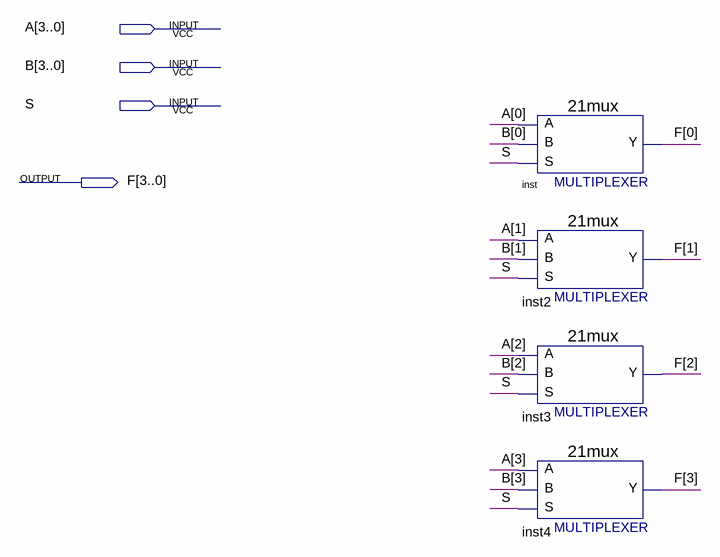
[diagram p0: schematic sheet]
// Quartus schematic BUSMUX_2x1_4Width.bdf as structural Verilog: 4 symbols, 4 pins
module BUSMUX_2x1_4Width (
  input  [3:0] A,
  input  [3:0] B,
  input  S,
  output [3:0] F
);

  \21mux  inst (.S(S), .B(B[0]), .A(A[0]), .Y(F[0]));
  \21mux  inst2 (.S(S), .B(B[1]), .A(A[1]), .Y(F[1]));
  \21mux  inst3 (.S(S), .B(B[2]), .A(A[2]), .Y(F[2]));
  \21mux  inst4 (.S(S), .B(B[3]), .A(A[3]), .Y(F[3]));
endmodule
